# Altium schematic sheet Sheet1.SchDoc
size A4
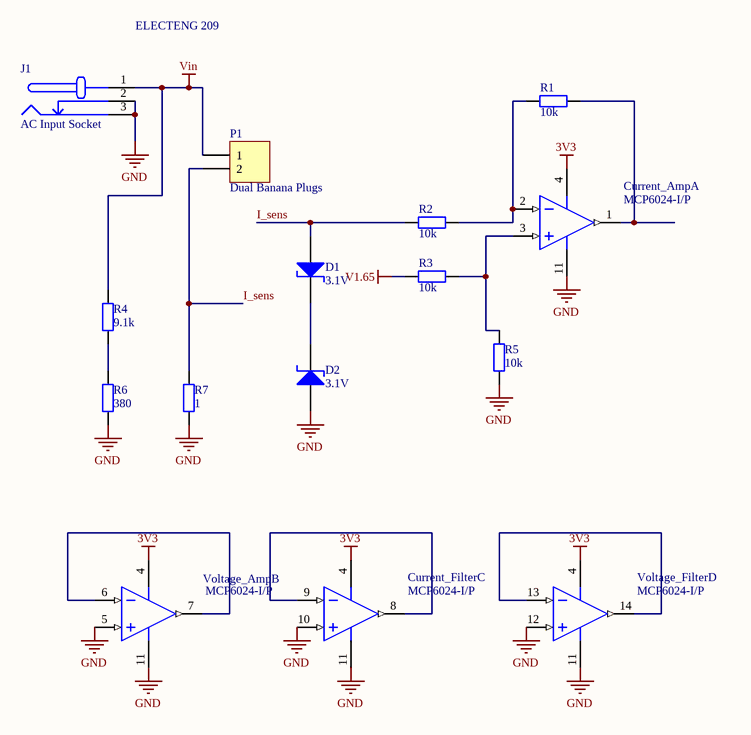
[diagram p0: Sheet1.SchDoc]

## Parts
Current_Amp  MCP6024-I/P  [DIP-14]  (part A of 4)
Current_Filter  MCP6024-I/P  [DIP-14]  (part C of 4)
D1  3.1V  [AXIAL-DIODE-0.4]
D2  3.1V  [AXIAL-DIODE-0.4]
J1  AC Input Socket  [AC-Socket]
P1  Dual Banana Plugs  [Dual Banana Plug]
R1  10k  [AXIAL-0.4]
R2  10k  [AXIAL-0.4]
R3  10k  [AXIAL-0.4]
R4  9.1k  [AXIAL-0.4]
R5  10k  [AXIAL-0.4]
R6  380  [AXIAL-0.4]
R7  1  [AXIAL-0.4]
Voltage_Amp  MCP6024-I/P  [DIP-14]  (part B of 4)
Voltage_Filter  MCP6024-I/P  [DIP-14]  (part D of 4)

## Nets
3V3: Current_Amp.4(VDD) Current_Filter.4(VDD) Voltage_Amp.4(VDD) Voltage_Filter.4(VDD)
GND: Current_Amp.11(VSS) Current_Filter.10(VINC+) Current_Filter.11(VSS) D2.1(A) J1.2(GND_ALT) J1.3(GND) R5.1 R6.1 R7.1 Voltage_Amp.5(VINB+) Voltage_Amp.11(VSS) Voltage_Filter.11(VSS) Voltage_Filter.12(VIND+)
V1.65: R3.2
Vin: J1.1(VCC) P1.1 R4.2
I_sens: D1.1(A) P1.2 R2.2 R7.2
NetCurrent_Amp_1: Current_Amp.1(VOUTA) R1.1
NetCurrent_Amp_2: Current_Amp.2(VINA-) R1.2 R2.1
NetCurrent_Amp_3: Current_Amp.3(VINA+) R3.1 R5.2
NetCurrent_Filter_8: Current_Filter.8(VOUTC) Current_Filter.9(VINC-)
NetD1_2: D1.2(K) D2.2(K)
NetR4_1: R4.1 R6.2
NetVoltage_Amp_6: Voltage_Amp.6(VINB-) Voltage_Amp.7(VOUTB)
NetVoltage_Filter_13: Voltage_Filter.13(VIND-) Voltage_Filter.14(VOUTD)

## Notes on the sheet
- ELECTENG 209

## Library data of the parts
Current_Amp Current_Filter Voltage_Amp Voltage_Filter = MCP6024-I/P: Rail-to-Rail Input/Output, 10 MHz Operational Amplifier, 14-Pin PDIP, Industrial Temperature; FirstPublished: 29-Jan-2009; LatestRevisionDate: 02-Dec-2009; LatestRevisionNote: Updated to datasheet revision D, Feb-2009; DatasheetVersion: revD, Feb-2009; PackageVersion: revBB, Aug-2009; PackageReference: PDIP300-P14; Publisher: Altium Limited; PackageDescription: 14-Lead Plastic Dual In-Line (P) - 300 mil Body [PDIP]; ComponentLink1Description: Datasheet; ComponentLink1URL: http://ww1.microchip.com/downloads/en/DeviceDoc/21685d.pdf; ComponentLink2Description: Packaging Specification; ComponentLink2URL: http://www.microchip.com/stellent/groups/techpub_sg/documents/packagingspec/en012702.pdf; ComponentLink3Description: Microchip.com Home; ComponentLink3URL: http://www.microchip.com/
D1 D2 = Zener: Zener Diode; Value: *
J1 = AC Input: Value: AC Input Socket
P1 = Dual Banana Plugs: M6 Holes; LatestRevisionDate: 17-Jul-2002; LatestRevisionNote: Re-released for DXP Platform.; Publisher: Altium Limited
R1-R7 = Res: Through Hole Resistor; Published: 8-Jun-2000; LatestRevisionDate: 17-Jul-2002; LatestRevisionNote: Re-released for DXP Platform.; PackageReference: AXIAL-0.4; Publisher: Altium Limited; Value: *